# Altium schematic sheet Main.SchDoc
size 420 x 297 mm; SheetNumber: 1; SheetTotal: 6
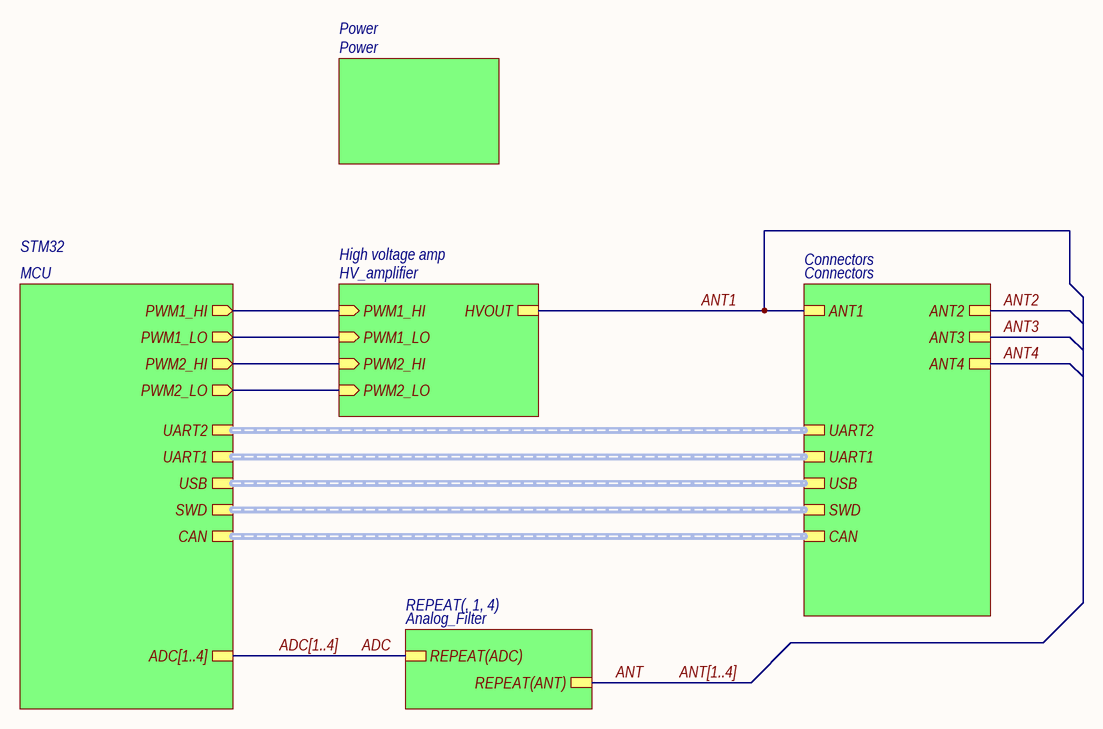
[diagram p0: Main.SchDoc]

## Sub-sheets
Connectors = Connectors: ANT1, ANT2, ANT3, ANT4, SWD (harness SWD), UART2 (harness UART), USB (harness USB), UART1 (harness UART-RS485), CAN (harness CAN)
High voltage amp = HV_amplifier: HVOUT, PWM1_HI (in), PWM1_LO (in), PWM2_HI (in), PWM2_LO (in)
Power = Power: no entries
REPEAT(, 1, 4) = Analog_Filter: REPEAT(ADC), REPEAT(ANT)
STM32 = MCU: PWM1_HI (out), PWM1_LO (out), PWM2_HI (out), PWM2_LO (out), ADC[1..4], UART2 (harness UART), UART1 (harness UART-RS485), USB (harness USB), SWD (harness SWD), CAN (harness CAN)

## Nets
ADC: sheet REPEAT(, 1, 4)/REPEAT(ADC)
ANT: sheet REPEAT(, 1, 4)/REPEAT(ANT)
ANT1: sheet Connectors/ANT1, sheet High voltage amp/HVOUT
ANT2: sheet Connectors/ANT2
ANT3: sheet Connectors/ANT3
ANT4: sheet Connectors/ANT4
(unnamed): sheet High voltage amp/PWM1_HI, sheet STM32/PWM1_HI
(unnamed): sheet High voltage amp/PWM1_LO, sheet STM32/PWM1_LO
(unnamed): sheet High voltage amp/PWM2_HI, sheet STM32/PWM2_HI
(unnamed): sheet High voltage amp/PWM2_LO, sheet STM32/PWM2_LO

## Buses and harness runs
bus ADC[1..4] = sheet STM32/ADC[1..4]
bus ANT[1..4]
harness sheet Connectors/CAN = sheet STM32/CAN
harness sheet Connectors/SWD = sheet STM32/SWD
harness sheet Connectors/UART1 = sheet STM32/UART1
harness sheet Connectors/UART2 = sheet STM32/UART2
harness sheet Connectors/USB = sheet STM32/USB

## Notes on the sheet
- Перв. примен.
- Справ. №
- Подп. и дата
- Инв. № дубл.
- Взам. инв. №
- Разраб.
- Изм.
- Лист
- № докум.
- Подп.
- Дата
- Лит.
- Масса
- Масштаб
- Пров.
- Т.контр.
- Схема электрическая принципиальная
- Листов
- Инв. № подл.
- Утв.
- Н.контр.
- Копировал
- Формат А3